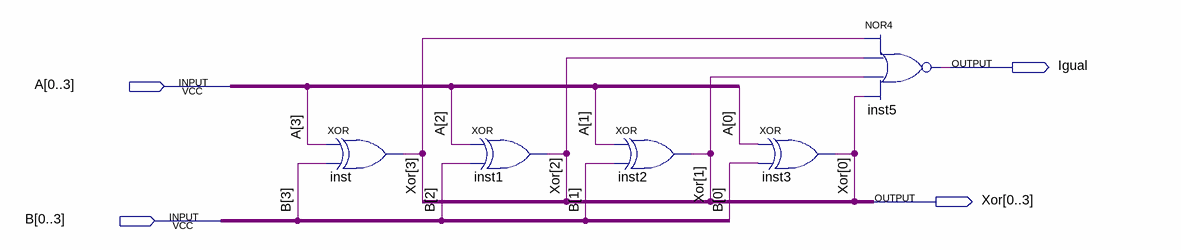
[diagram p0: schematic sheet]
// Quartus schematic Xor.bdf as structural Verilog: 5 symbols, 4 pins
module Xor (
  input  [0:3] A,
  input  [0:3] B,
  output Igual,
  output [0:3] Xor
);

  xor inst (Xor[3], A[3], B[3]);
  xor inst1 (Xor[2], A[2], B[2]);
  xor inst2 (Xor[1], A[1], B[1]);
  xor inst3 (Xor[0], A[0], B[0]);
  nor inst5 (Igual, Xor[3], Xor[2], Xor[1], Xor[0]);
endmodule
